# EAGLE design charger_breakout (EAGLE 7.4.0)
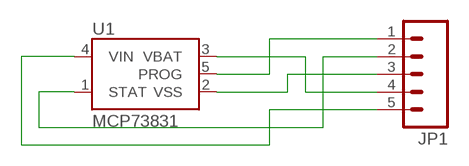
[diagram p0: schematic, sheet 1]

## Parts
JP1  M05PTH  [1X05]
U1  MCP73831  [SOT23-5]

## Nets
N$1: JP1.1 U1.5(PROG)
N$2: JP1.5 U1.4(VIN)
N$3: JP1.4 U1.3(VBAT)
N$4: JP1.3 U1.2(VSS)
N$5: JP1.2 U1.1(STAT)

## Library data of the parts
JP1 = SparkFun-Connectors:M05: Header 5 Standard 5-pin 0.1" header. Use with straight break away headers (SKU : PRT-00116), right angle break away headers (PRT-00553), swiss pins (PRT-00743), machine pins (PRT-00117), and female headers (PRT-00115). Molex polarized connector foot print use with SKU : PRT-08230 with associated crimp pins and housings.
U1 = SparkFun-PowerIC:MCP73831: Miniature single cell, fully integrated Li-Ion, Li-polymer charge management controller http://ww1.microchip.com/downloads/en/DeviceDoc/20001984g.pdf IC-09995; PROD_ID: IC-09995

## Board
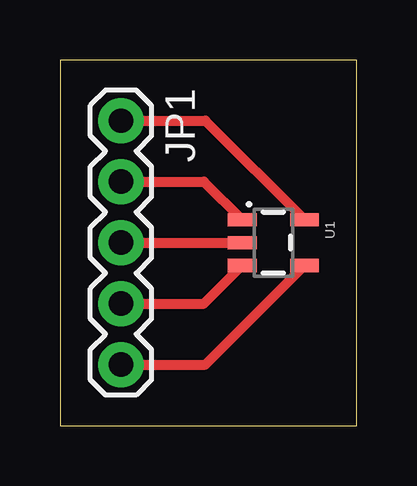
[diagram p1: board, top side]

Size 12.37 x 15.23 mm. Coordinates in mm from the lower left corner, seen from the top.
Outline: 0,0 12.37,0 12.37,15.23 0,15.23 0,0
Copper layers (1*16): Top 0.035mm / dielectric 1.5mm / Bottom 0.035mm
Design rules "default": minimum track width 10mil, minimum drill 24mil, track to track 8mil, track to pad 8mil, pad to pad 8mil, via to via 8mil, smd to smd 8mil, copper to edge 40mil, drill to drill 8mil, minimum pad ring 10mil, minimum via ring 8mil, stop-mask expansion 4mil, vias tented up to drill 0mil, thermal gap 10mil

### Footprints (pad centres in the part's own frame; a part is rotated, then mirrored left to right if it is on the bottom)
1X05 = drill 1.016 pad 1.88: 1 0,0; 2 2.54,0; 3 5.08,0; 4 7.62,0; 5 10.16,0
SOT23-5 = smd 0.55 x 1.2: 1 -0.95,-1.3; 2 0,-1.3; 3 0.95,-1.3; 4 0.95,1.3; 5 -0.95,1.3

### Placement (x,y rotation side)
JP1  2.54,12.7 270 top
U1  8.89,7.62 270 top

### Tracks (layer width: path | path; a pad name or v marks a point on that pad's centre or on a via)
N$1
  Top 0.406: JP1.1 6.06,12.7 U1.5
N$2
  Top 0.406: JP1.5 6.06,2.54 U1.4
N$3
  Top 0.406: JP1.4 6,5.08 U1.3
N$4
  Top 0.406: JP1.3 U1.2
N$5
  Top 0.406: JP1.2 6,10.16 U1.1